# EAGLE schematic tax fraud 2 (EAGLE 9.5.1)
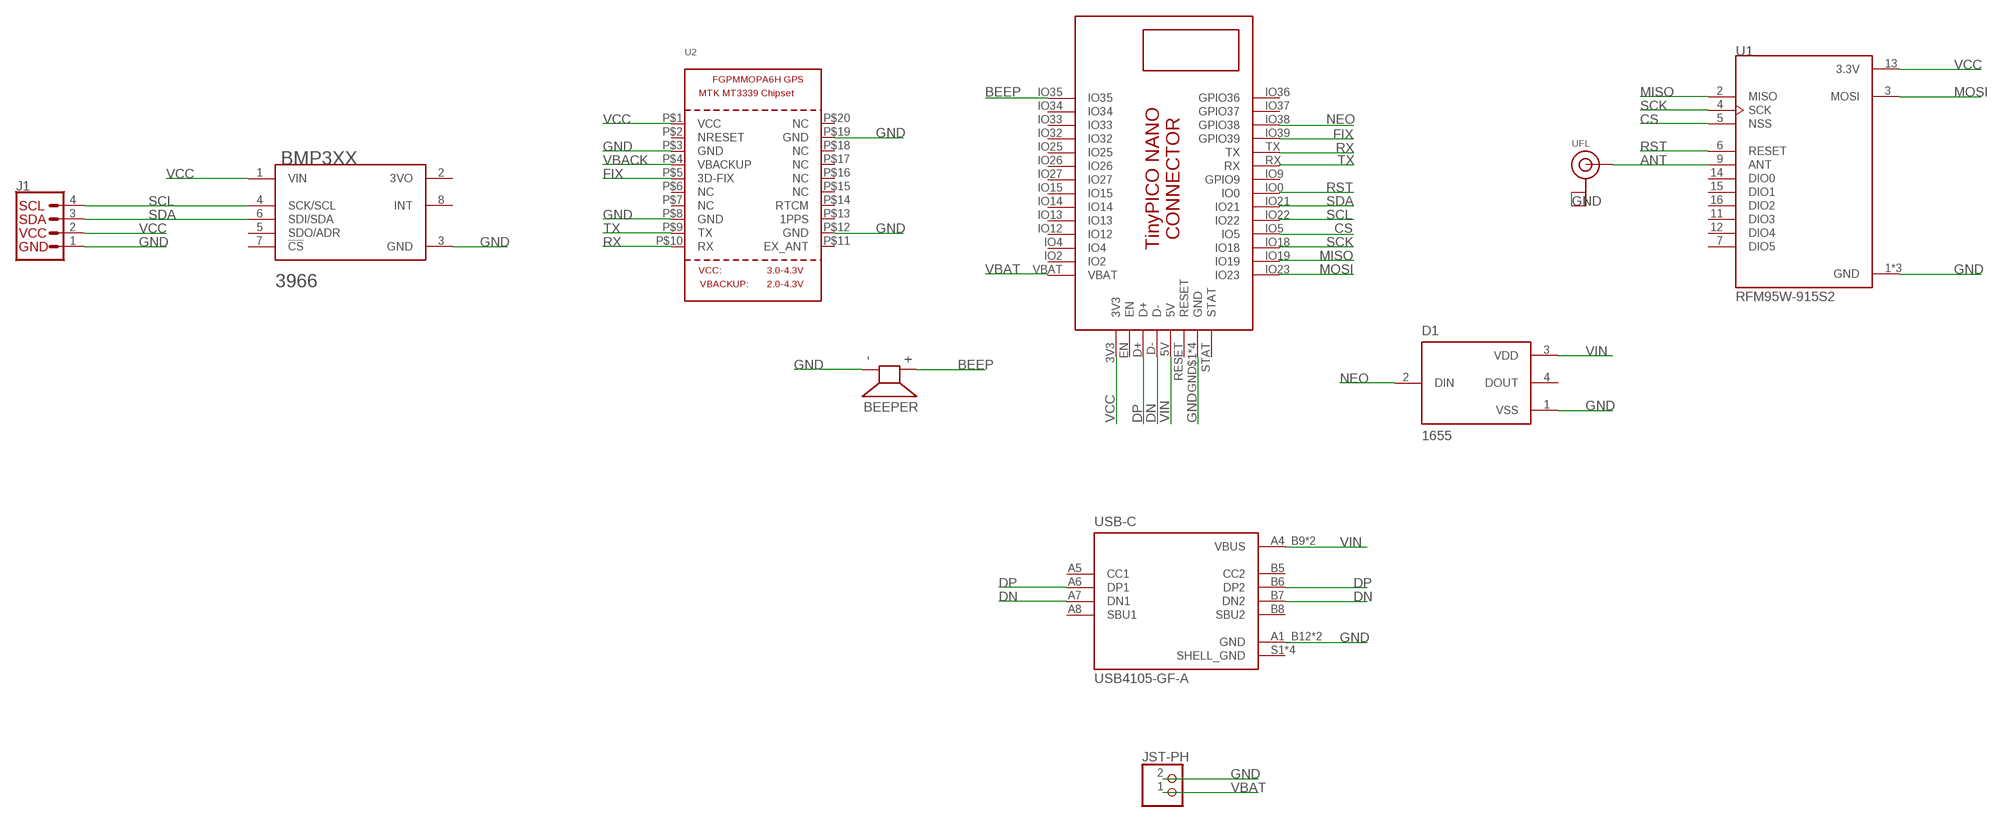
[diagram p0: schematic, sheet 1]

## Parts
BEEPER  AI-1223-TWT-12V-R  [XDCR_AI-1223-TWT-12V-R]
BMP3XX  ADAFRUIT_INDUSTRIES_3966ADAFRUIT_INDUSTRIES_3966_0_0  [ADAFRUIT_INDUSTRIES_3966_0]
D1  1655  [LED_1655]
J1  QWIIC_CONNECTORJS-1MM  [1X04_1MM_RA]
JST-PH  JST_2PIN-SMT-RA  [JST-PH-2-SMT-RA]
U1  RFM95W-915S2  [XCVR_RFM95W-915S2]
U2  GPS_FGPMMOPA6H  [FGPMMOPA6H]
U$1  TINYPICO-NANO-CONNECTOR  [TINYPICO-NANO-CONNECTOR]
UFL  ANTENNA_U.FL  [U.FL]
USB-C  USB4105-GF-A  [GCT_USB4105-GF-A]

## Nets
ANT: U1.9(ANT) UFL.3(SIGNAL)
BEEP: BEEPER.P(+) U$1.IO35
CS: U1.5(NSS) U$1.IO5
DN: U$1.D- USB-C.A7(DN1) USB-C.B7(DN2)
DP: U$1.D+ USB-C.A6(DP1) USB-C.B6(DP2)
FIX: U2.P$5(3D-FIX) U$1.IO39(GPIO39)
GND: BEEPER.N(-) BMP3XX.3(GND) D1.1(VSS) J1.1(GND) JST-PH.2 U1.1(GND) U1.8(GND) U1.10(GND) U2.P$3(GND) U2.P$8(GND) U2.P$12(GND) U2.P$19(GND) U$1.GND$1(GND) U$1.GND$2(GND) U$1.GND$3(GND) U$1.GND$4(GND) UFL.1(GND) UFL.2(GND) USB-C.A1_B12(GND) USB-C.B1_A12(GND)
MISO: U1.2(MISO) U$1.IO19
MOSI: U1.3(MOSI) U$1.IO23
NEO: D1.2(DIN) U$1.IO38(GPIO38)
RST: U1.6(RESET) U$1.IO0
RX: U2.P$10(RX) U$1.TX
SCK: U1.4(SCK) U$1.IO18
SCL: BMP3XX.4(SCK/SCL) J1.4(SCL) U$1.IO22
SDA: BMP3XX.6(SDI/SDA) J1.3(SDA) U$1.IO21
TX: U2.P$9(TX) U$1.RX
VBACK: U2.P$4(VBACKUP)
VBAT: JST-PH.1 U$1.VBAT
VCC: BMP3XX.1(VIN) J1.2(VCC) U1.13(3.3V) U2.P$1(VCC) U$1.3V3
VIN: D1.3(VDD) U$1.5V USB-C.A4_B9(VBUS) USB-C.B4_A9(VBUS)
Unconnected: BMP3XX.5(SDO/ADR) BMP3XX.7(!CS!) BMP3XX.8(INT) D1.4(DOUT) U1.7(DIO5) U1.11(DIO3) U1.12(DIO4) U1.14(DIO0) U1.15(DIO1) U1.16(DIO2) U2.P$2(NRESET) U2.P$6(NC) U2.P$7(NC) U2.P$11(EX_ANT) U2.P$13(1PPS) U2.P$14(RTCM) U2.P$15(NC) U2.P$16(NC) U2.P$17(NC) U2.P$18(NC) U2.P$20(NC) U$1.EN U$1.IO2 U$1.IO4 U$1.IO9(GPIO9) U$1.IO12 U$1.IO13 U$1.IO14 U$1.IO15 U$1.IO25 U$1.IO26 U$1.IO27 U$1.IO32 U$1.IO33 U$1.IO34 U$1.IO36(GPIO36) U$1.IO37(GPIO37) U$1.RESET U$1.STAT USB-C.A5(CC1) USB-C.A8(SBU1) USB-C.B5(CC2) USB-C.B8(SBU2)

## Power pins joined to a net without a drawn wire
3VO: BMP3XX.2(3VO)
SHELL_GND: USB-C.S1(SHELL_GND) USB-C.S2(SHELL_GND) USB-C.S3(SHELL_GND) USB-C.S4(SHELL_GND)

## Library data of the parts
BEEPER = buzzer:AI-1223-TWT-12V-R: Check availability <https://pricing.snapeda.com/parts/AI-1223-TWT-12V-R/PUI%20Audio%2C/view-part?ref=eda>; AVAILABILITY: In Stock; DESCRIPTION: ELECTRO-MECHANICAL AUDIO INDICATOR; MF: PUI Audio,; MP: AI-1223-TWT-12V-R; PACKAGE: None; PRICE: None; PURCHASE-URL: https://pricing.snapeda.com/search/part/AI-1223-TWT-12V-R/?ref=eda
BMP3XX = BMP388 Breakout:ADAFRUIT_INDUSTRIES_3966: BMP388 series Pressure Sensor Evaluation Board; AUTOMOTIVE: No; CENTROID_NOT_SPECIFIED: No; DATASHEET: https://cdn-learn.adafruit.com/downloads/pdf/adafruit-bmp388-bmp390-bmp3xx.pdf?timestamp=1628517945; DEVICE_CLASS_L1: Sensors; DEVICE_CLASS_L2: Pressure Sensors; DEVICE_CLASS_L3: unset; DIGIKEY_DESCRIPTION: BMP388 - PRECISION BAROMETRIC PR; DIGIKEY_PART_NUMBER: 1528-2733-ND; FOOTPRINT_VARIANT_NAME_0: Recommended_Land_Pattern; LEAD_FREE: Yes; MF: Adafruit Industries; MFG_PACKAGE_IDENT: 0; MFG_PACKAGE_IDENT_DATE: 0; MFG_PACKAGE_IDENT_REV: 0; MOUSER_PART_NUMBER: 485-3966; MPN: 3966; PACKAGE: MODULE_25MM40_17MM78; PIN_0_0_4_INSIDE_EDGE: clock; PREFIX: MD; ROHS: Yes; SENSOR_OUTPUT: I2C,SPI; VERIFICATION_VERSION: 0.0.0.3
D1 = 5050 NeoPixel:1655: Ws2812b 5050 Rgb Led With Integrated Driver Chip Pack Of 10 Check availability <https://pricing.snapeda.com/parts/1655/Adafruit/view-part?ref=eda>; AVAILABILITY: In Stock; DESCRIPTION: Addressable Lighting Neopixel 10 LED Discrete Serial (Shift Register) Red, Green, Blue (RGB) 5.00mm L x 5.00mm W; MF: Adafruit; MP: 1655; PACKAGE: None; PRICE: None; PURCHASE-URL: https://pricing.snapeda.com/search/part/1655/?ref=eda
J1 = SparkFun-Connectors:QWIIC_CONNECTOR: SparkFun I2C Standard Qwiic Connector An SMD 1mm pitch JST connector makes it easy and quick (get it? Qwiic?) to connect I2C devices to each other. The Qwiic system <http://www.sparkfun.com/qwiic> enables fast and solderless connection between popular platforms and various sensors and actuators. We carry 200mm <https://www.sparkfun.com/products/14204>, 100mm <https://www.sparkfun.com/products/14205>, 50mm <https://www.sparkfun.com/products/14206>, and breadboard friendly <https://www.sparkfun.com/products/14207> Qwiic cables. We also offer 10 pcs strips <https://www.sparkfun.com/products/14323> the SMD connectors.
JST-PH = adafruit:JST_2PIN: JST 2-Pin Connectors of various flavors SMT-RA (S2B-PH-SM4) 4UConnector #17311 SMT (B2B-PH-SM4) THM-RA (S2B-PH) THM (B2B-PH)
U1 = RFM95W-915S2:RFM95W-915S2: RFM95(W) - Low Power Long Range Transceiver Module V1.0 Check availability <https://pricing.snapeda.com/parts/RFM95W-915S2/RF%20Solutions/view-part?ref=eda>; AVAILABILITY: In Stock; DESCRIPTION: 802.15.4 LoRa™ Transceiver Module 915MHz Antenna Not Included Surface Mount; MF: RF Solutions; MP: RFM95W-915S2; PACKAGE: Non Standard RF Solutions; PRICE: None; PURCHASE-URL: https://pricing.snapeda.com/search/part/RFM95W-915S2/?ref=eda
U2 = adafruit:GPS_FGPMMOPA6H: GPS Module - MTK MT3339 Chipset, -165dBm sensitivity, 22 channels, 10Hz, auto-select external antenna options
U$1 = TinyPICO_NANO_Eagle:TINYPICO-NANO-CONNECTOR: TinyPICO NANO Footprint https://www.tinypico.com/tinypico-nano
UFL = adafruit:ANTENNA_U.FL: U.FL Antenna Connector
USB-C = USB-C Adafruit USB4105-GF-A:USB4105-GF-A: USB-C (USB TYPE-C) USB 2.0 Receptacle Connector 24 (16+8 Dummy) Position Surface Mount, Right Angle; Through Hole; DESCRIPTION: USB-C (USB TYPE-C) USB 2.0 Receptacle Connector 24 (16+8 Dummy) Position Surface Mount, Right Angle; Through Hole; DIGI-KEY_PART_NUMBER: 2073-USB4105-GF-ATR-ND; MF: GCT; MP: USB4105-GF-A; PACKAGE: None; PURCHASE-URL: https://pricing.snapeda.com/search/part/USB4105-GF-A/?ref=eda